# Altium schematic sheet 8.RTC.SchDoc: RTC
size A; SheetNumber: 8; SheetTotal: 16
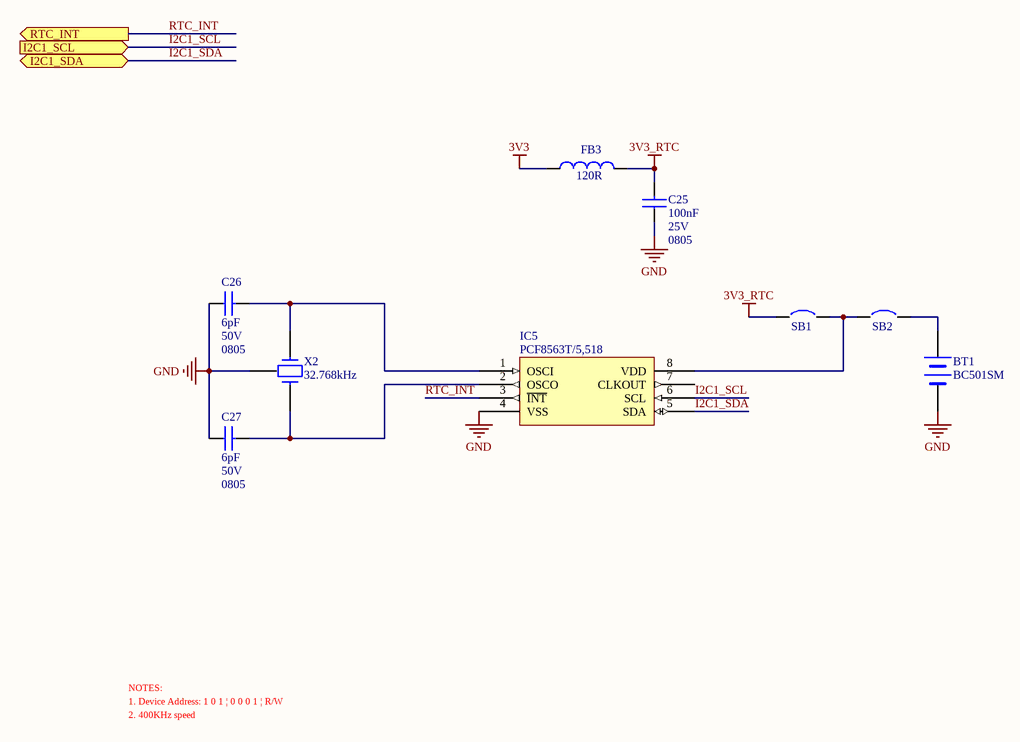
[diagram p0: 8.RTC.SchDoc]

## Parts
BT1  value BC501SM  [MPD_BC501SM]  (hidden comment: BATTERY)
C25  Capacitance: 100nF  Voltage - Rated: 25V  Package / Case: 0805  [CAPC2012X100N_EIA0805]  (hidden comment: CAP_NP)
C26  Capacitance: 6pF  Voltage - Rated: 50V  Package / Case: 0805  [CAPC2012X100N_EIA0805]  (hidden comment: CAP_NP)
C27  Capacitance: 6pF  Voltage - Rated: 50V  Package / Case: 0805  [CAPC2012X100N_EIA0805]  (hidden comment: CAP_NP)
FB3  Impedance: 120R  [FILC2012X100N_EIA0805]  (hidden comment: BEAD)
IC5  Manufacturer Part Number: PCF8563T/5,518  [SOIC127P600X175-8N]  (hidden comment: PC58563)
SB1  SOLDER_BRIDGE  [SOLDER_BRIDGE_0805]  (value not drawn)
SB2  SOLDER_BRIDGE  [SOLDER_BRIDGE_0805]  (value not drawn)
X2  value 32.768kHz  [32.768_DIP]  (hidden comment: CRYSTAL_32K)

## Ports
I2C1_SCL (in), I2C1_SDA (bidir), RTC_INT (out)

## Nets
3V3: FB3.1
3V3_RTC: C25.2 FB3.2 SB1.1
GND: BT1.2(-) C25.1 C26.1 C27.1 IC5.4(VSS) X2.3
I2C1_SCL: IC5.6(SCL) ; port I2C1_SCL
I2C1_SDA: IC5.5(SDA) ; port I2C1_SDA
RTC_INT: IC5.3(~{INT}) ; port RTC_INT
NetBT1_1: BT1.1(+) SB2.2
NetC26_2: C26.2 IC5.1(OSCI) X2.2
NetC27_2: C27.2 IC5.2(OSCO) X2.1
NetIC5_8: IC5.8(VDD) SB1.2 SB2.1

Not connected (* = marked no-connect by the designer): IC5 7(CLKOUT)

## Notes on the sheet
- NOTES:
- 1. Device Address: 1 0 1 | 0 0 0 1 | R/W
- 2. 400KHz speed

## Library data of the parts
BT1 = SBAT00011: HOLDER COIN CELL FOR CR1220 SMD; Manufacturer: MPD (Memory Protection Devices); Voltage: 3V; Battery Chemistry: Coin Cell, Holder; Battery Cell Size: Coin, 12.0mm; Cost x10 ($): 0.81000; Cost x100 ($): 0.73000; Cost x1000 ($): 0.59000; Distrubutor: Digikey; Lead Time: 12 Weeks; Cost x1 ($): 0.88000; Part Number: SBAT00011; Mounting Type: PCB, Surface Mount; Category: Battery Products; Family: Battery Holders, Clips, Contacts; Manufacturer Part Number: BC501SM; Distributor Part Number: BC501SM-ND; ROHS: YES; Distributor Link: http://www.digikey.com/product-detail/en/mpd-memory-protection-devices/BC501SM/BC501SM-ND/2439260; Quantity: 20
C25 = SCAP00300093: CAP CER 0.1UF 25V X7R 0805; Manufacturer: Samsung Electro-Mechanics America, Inc.; Manufacturer Part Number: CL21B104KACNNNC; Value: 100nF; Tolerance: ±10%; Type: Multi Layer Ceramic Capacitor  (MLCC); Cost x1 ($): 0.10000; Cost x10 ($): 0.03300; Cost x100 ($): 0.01470; Cost x1000 ($): 0.00825; Distrubutor: Digikey; Lead Time: 11 Weeks; Part Number: SCAP00300093; Temperature Coefficient: X7R; Operating Temperature: -55°C ~ 125°C; Mounting Type: Surface Mount, MLCC; Size / Dimension: 0.079" L x 0.049" W (2.00mm x 1.25mm); Category: Capacitors; Family: Ceramic Capacitors; Distributor Part Number: 1276-1099-1-ND; Distributor Link: http://www.digikey.com/product-detail/en/samsung-electro-mechanics-america-inc/CL21B104KACNNNC/1276-1099-1-ND/3889185; ROHS: YES; Moisture Sensitivity Level (MSL): 1 (Unlimited); Quantity: 50
C26 C27 = SCAP00300025: CAP CER 6PF 50V NP0 0805; Manufacturer: Samsung Electro-Mechanics America, Inc.; Manufacturer Part Number: CL21C060CBANNNC; Tolerance: ±0.25pF; Temperature Coefficient: C0G, NP0; Type: Multi Layer Ceramic Capacitor  (MLCC); Cost x1 ($): 0.10000; Cost x10 ($): 0.01900; Cost x100 ($): 0.00860; Cost x1000 ($): 0.00481; Distrubutor: Digikey; Lead Time: 11 Weeks; Part Number: SCAP00300025; Value: 6pF; Operating Temperature: -55°C ~ 125°C; Mounting Type: Surface Mount, MLCC; Size / Dimension: 0.079" L x 0.049" W (2.00mm x 1.25mm); Category: Capacitors; Family: Ceramic Capacitors; Distributor Part Number: 1276-1767-1-ND; Distributor Link: http://www.digikey.com/product-detail/en/samsung-electro-mechanics-america-inc/CL21C060CBANNNC/1276-1767-1-ND/3889853; ROHS: YES; Moisture Sensitivity Level (MSL): 1 (Unlimited); Quantity: 50
FB3 = SFIL00005: FERRITE CHIP POWER 120 OHM SMD; Manufacturer: Laird-Signal Integrity Products; Manufacturer Part Number: HI0805O121R-10; Type: Differential Mode - Single; Current Rating: 3.5A; DC Resistance (DCR): 20 mOhm Max; Cost x10 ($): 0.08700; Cost x100 ($): 0.05230; Cost x1000 ($): 0.03010; Distrubutor: Digikey; Cost x1 ($): 0.10000; Part Number: SFIL00005; Package / Case: 0805 (2012 Metric); Value: BEAD; Category: Filters; Family: Ferrite Beads and Chips; Distributor Part Number: 240-2393-1-ND; ROHS: YES; Datasheet Link: http://www.digikey.com/product-detail/en/HI0805O121R-10/240-2393-1-ND/806753; Quantity: 50
IC5 = SIC00132: IC RTC CLK/CALENDAR I2C 8-SOIC; Manufacturer: NXP Semiconductors; Value: PCF8563; Vin: 1.8 V ~ 5.5 V; Protocol: I²C, 2-Wire Serial; Iin: 0.6µA ~ 0.75µA @ 2V ~ 5V; Cost x10 ($): 0.74300; Cost x100 ($): 0.56810; Cost x1000 ($): 0.36053; Distrubutor: Digikey; Lead Time: 7 Weeks; Cost x1 ($): 0.85000; Part Number: SIC00132; Operating Temperature: -40°C ~ 85°C; Category: Integrated Circuits (ICs); Family: Clock/Timing - Real Time Clocks; Package / Case: 8-SOIC (0.154", 3.90mm Width); Type: Clock/Calendar; Distributor Part Number: 568-6650-1-ND; ROHS: YES; Distributor Link: http://www.digikey.com/product-detail/en/nxp-semiconductors/PCF8563T-5,518/568-6650-1-ND/2617089; MSL: 2 (1 Year); Quantity: 10
SB1 SB2 = SMSC00006: SOLDER BRIDGE 0805; Part Number: SMSC00006; Value: SOLDER_BRIDGE
X2 = SCRY00009: CRYSTAL 32.768KHZ 6PF THRU; Manufacturer: Seiko Instruments; Manufacturer Part Number: VT200F-6PF20PPM; Frequency Tolerance: ±20ppm; ESR: 50 kOhm; Cost x10 ($): 0.25000; Cost x100 ($): 0.20000; Cost x1000 ($): 0.16000; Distrubutor: Digikey; Lead Time: 11 Weeks; Cost x1 ($): 0.30000; Part Number: SCRY00009; Mounting Type: Through Hole; Load Capacitance: 6pF; Package / Case: Cylindrical Can, Radial; Type: kHz Crystal (Tuning Fork); Distributor Part Number: 728-1000-ND; ROHS: YES; Datasheet Link: http://www.digikey.com/product-detail/en/VT200F-6PF20PPM/728-1000-ND/1626715; Quantity: 10